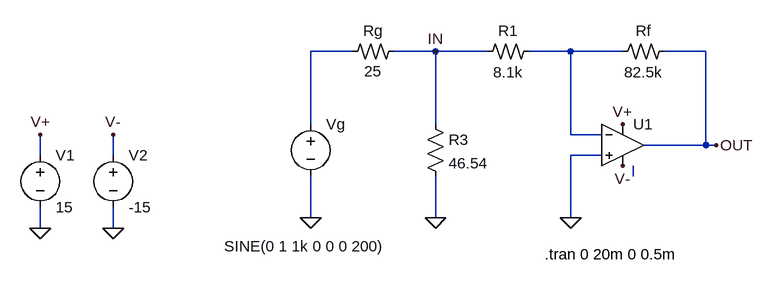
[diagram p0: schematic OpAmp_simulation.asc]
OpAmp_simulation.asc, the LTspice schematic file:
Version 4
SHEET 1 1644 800
WIRE 720 256 656 256
WIRE 848 256 784 256
WIRE 928 256 848 256
WIRE 1056 256 992 256
WIRE 1136 256 1056 256
WIRE 1264 256 1200 256
WIRE 656 368 656 256
WIRE 848 368 848 256
WIRE 1056 384 1056 256
WIRE 1104 384 1056 384
WIRE 1264 400 1264 256
WIRE 1264 400 1168 400
WIRE 1280 400 1264 400
WIRE 240 416 240 384
WIRE 352 416 352 384
WIRE 1104 416 1056 416
WIRE 1152 448 1152 432
WIRE 656 512 656 448
WIRE 848 512 848 448
WIRE 1056 512 1056 416
WIRE 240 528 240 496
WIRE 352 528 352 496
FLAG 240 528 0
FLAG 352 528 0
FLAG 240 384 V+
FLAG 352 384 V-
FLAG 1056 512 0
FLAG 1280 400 OUT
FLAG 848 256 IN
FLAG 1136 432 V-
FLAG 1136 368 V+
FLAG 656 512 0
FLAG 848 512 0
SYMBOL voltage 240 400 R0
WINDOW 123 24 126 Left 2
WINDOW 39 24 111 Left 2
SYMATTR InstName V1
SYMATTR Value 15
SYMBOL voltage 352 400 R0
WINDOW 123 24 126 Left 2
WINDOW 39 24 111 Left 2
SYMATTR InstName V2
SYMATTR Value -15
SYMBOL Opamps/UniversalOpamp2 1136 400 R0
SYMATTR InstName U1
SYMBOL res2 992 240 R90
WINDOW 0 0 32 VBottom 2
WINDOW 3 32 32 VTop 2
SYMATTR InstName R1
SYMATTR Value 8.1k
SYMBOL res2 1200 240 R90
WINDOW 0 0 32 VBottom 2
WINDOW 3 32 32 VTop 2
SYMATTR InstName Rf
SYMATTR Value 82.5k
SYMBOL res 832 352 R0
SYMATTR InstName R3
SYMATTR Value 46.54
SYMBOL res2 784 240 R90
WINDOW 0 0 32 VBottom 2
WINDOW 3 31 32 VTop 2
SYMATTR InstName Rg
SYMATTR Value 25
SYMBOL voltage 656 352 R0
WINDOW 3 -133 204 Left 2
WINDOW 123 0 0 Left 0
WINDOW 39 0 0 Left 0
SYMATTR Value SINE(0 1 1k 0 0 0 200)
SYMATTR InstName Vg
TEXT 1016 568 Left 2 !.tran 0 20m 0 0.5m

The netlist it stands for:
* OpAmp_simulation.asc
V1 V+ 0 15
V2 V- 0 -15
XU1 0 N002 V+ V- OUT level.2 Avol=1Meg GBW=10Meg Slew=10Meg ilimit=25m rail=0 Vos=0 phimargin=45 en=0 enk=0 in=0 ink=0 Rin=500Meg  ; pins IN+ IN- V+ V- OUT
R1 N002 IN 8.1k
Rf OUT N002 82.5k
R3 IN 0 46.54
Rg IN N001 25
Vg N001 0 SINE(0 1 1k 0 0 0 200)
.tran 0 20m 0 0.5m
.lib UniversalOpamps2.sub
.backanno
.end